# EAGLE design detector_full (EAGLE 9.0.1)
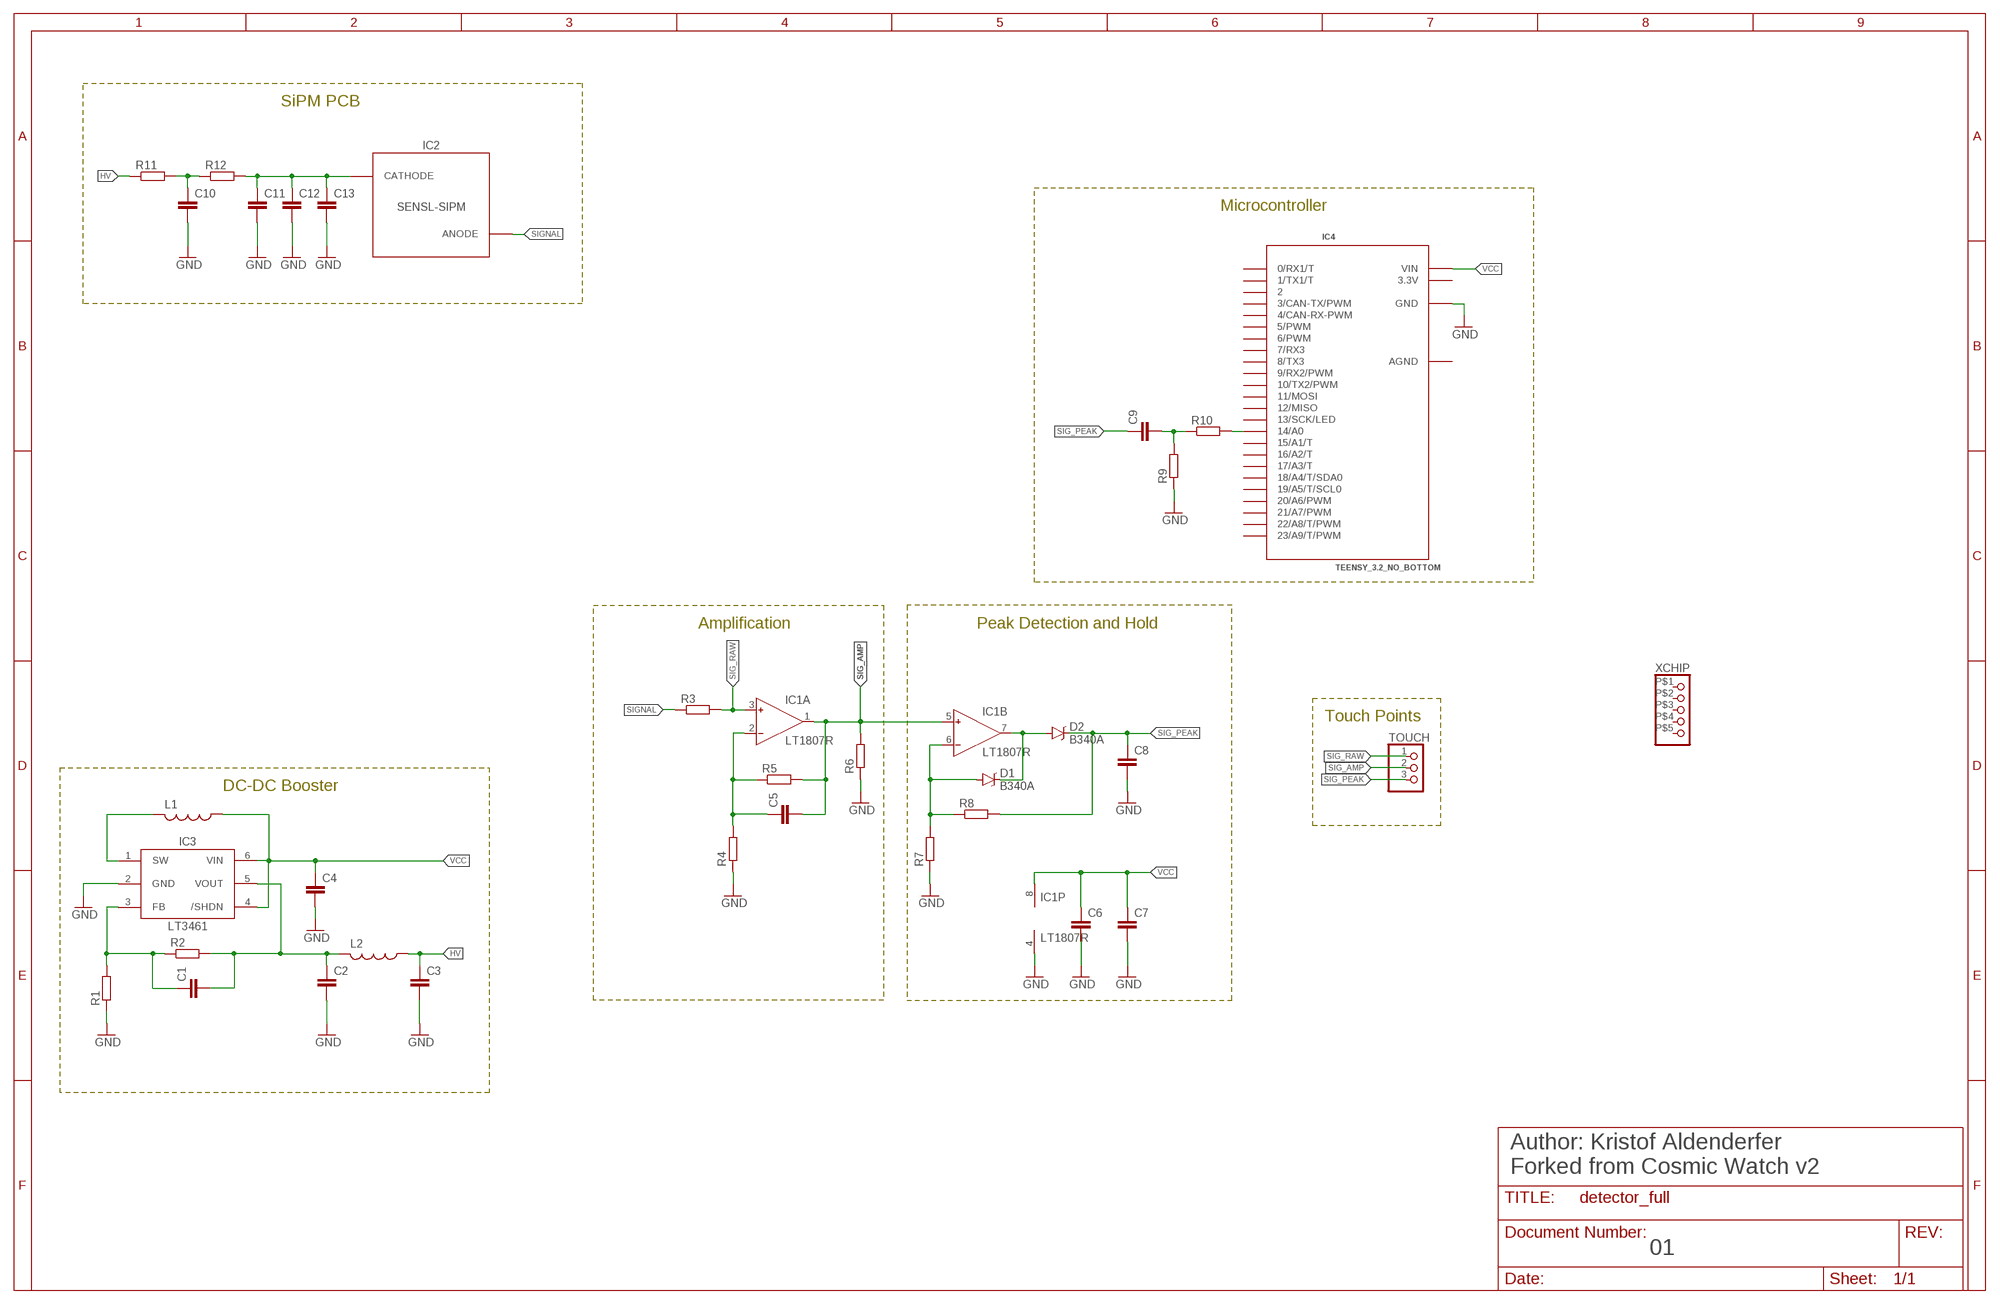
[diagram p0: schematic, sheet 1]

## Parts
C1  C-EUC0805K  [C0805K]
C2  C-EUC0805K  [C0805K]
C3  C-EUC0805K  [C0805K]
C4  C-EUC0805K  [C0805K]
C5  C-EUC0805K  [C0805K]
C6  C-EUC0805K  [C0805K]
C7  C-EUC0805K  [C0805K]
C8  C-EUC0805K  [C0805K]
C9  C-EUC0805K  [C0805K]
C10  C-EUC0805K  [C0805K]
C11  C-EUC0805K  [C0805K]
C12  C-EUC0805K  [C0805K]
C13  C-EUC0805K  [C0805K]
D1  B340A  DIODE-SCHOTTKY-B340A  [SMA-DIODE]
D2  B340A  DIODE-SCHOTTKY-B340A  [SMA-DIODE]
IC1  LT1807R  [SO8]
IC2  SENSL-SIPM  [MICROFC-60035]
IC3  LT3461  [SOT23-6]
IC4  TEENSY_3.2_NO_BOTTOM  [TEENSY_3.2_NO_BOTTOM]
L1  L-USL2012C  [L2012C]
L2  L-USL2012C  [L2012C]
R1  R-EU_M0805  [M0805]
R2  R-EU_M0805  [M0805]
R3  R-EU_M0805  [M0805]
R4  R-EU_M0805  [M0805]
R5  R-EU_M0805  [M0805]
R6  R-EU_M0805  [M0805]
R7  R-EU_M0805  [M0805]
R8  R-EU_M0805  [M0805]
R9  R-EU_M0805  [M0805]
R10  R-EU_M0805  [M0805]
R11  R-EU_M0805  [M0805]
R12  R-EU_M0805  [M0805]
TOUCH  PINHD-1X3  [1X03]
XCHIP  XCHIP-1X5  [1X05_PAD]

## Nets
GND: C2.2 C3.2 C4.2 C6.2 C7.2 C8.2 C10.2 C11.2 C12.2 C13.2 IC1.4(P:V-) IC3.2(GND) IC4.GND R1.1 R4.1 R6.1 R7.1 R9.1
HV: C3.1 L2.1 R11.1
N$1: IC3.1(SW) L1.2
N$2: D1.C D2.A IC1.7(B:OUT)
N$3: C1.1 IC3.3(FB) R1.2 R2.1
N$4: D1.A IC1.6(B:IN-) R7.2 R8.1
N$5: C11.1 C12.1 C13.1 IC2.CATHODE R12.2
N$6: C10.1 R11.2 R12.1
N$7: C1.2 C2.1 IC3.5(VOUT) L2.2 R2.2
N$8: C5.1 IC1.2(A:IN-) R4.2 R5.1
N$9: C9.2 R9.2 R10.1
N$10: IC4.14/A0 R10.2
SIG_AMP: C5.2 IC1.1(A:OUT) IC1.5(B:IN+) R5.2 R6.2 TOUCH.2
SIG_PEAK: C8.1 C9.1 D2.C R8.2 TOUCH.3
SIG_RAW: IC1.3(A:IN+) R3.2 TOUCH.1
SIGNAL: IC2.ANODE R3.1
VCC: C4.1 C6.1 C7.1 IC1.8(P:V+) IC3.4(/SHDN) IC3.6(VIN) IC4.VIN L1.1
Unconnected: IC4.0(0/RX1/T) IC4.1(1/TX1/T) IC4.2 IC4.3(3/CAN-TX/PWM) IC4.4(4/CAN-RX-PWM) IC4.5(5/PWM) IC4.6(6/PWM) IC4.7(7/RX3) IC4.8(8/TX3) IC4.9(9/RX2/PWM) IC4.10(10/TX2/PWM) IC4.11(11/MOSI) IC4.12(12/MISO) IC4.13(13/SCK/LED) IC4.15/A1(15/A1/T) IC4.16/A2(16/A2/T) IC4.17/A3(17/A3/T) IC4.18/A4(18/A4/T/SDA0) IC4.19/A5(19/A5/T/SCL0) IC4.20/A6(20/A6/PWM) IC4.21/A7(21/A7/PWM) IC4.22/A8(22/A8/T/PWM) IC4.23/A9(23/A9/T/PWM) XCHIP.P$1 XCHIP.P$2 XCHIP.P$3 XCHIP.P$4 XCHIP.P$5

## Notes on the sheet
- SiPM PCB
- Microcontroller
- Amplification | Peak Detection and Hold
- Touch Points
- DC-DC Booster
- Author: Kristof Aldenderfer
  Forked from Cosmic Watch v2
- 01

## Power pins joined to a net without a drawn wire
3.3V: IC4.3.3V
AGND: IC4.AGND

## Library data of the parts
C1-C13 = rcl:C-EU: CAPACITOR, European symbol; SPICEPREFIX: C
D1 D2 = SparkFun-DiscreteSemi:DIODE-SCHOTTKY: Schottky diodes in SFE's production catalog BAT20J 1A 23V 0.62Vf RB751 120mA 40V 0.37Vf PMEG4005EJ 0.5A 40V 0.42Vf MBRA140 1A 40V 0.5Vf B340A 3A 40V SMA; PROD_ID: DIO-09886
IC1 = personal:LT1807: Dual Precision, 500 ns Settling, BiFET Op Amp Source: http://www.analog.com/static/imported-files/data_sheets/AD746.pdf; MF: ALTERA CORPORATION; MPN: AD746JRZ; OC_FARNELL: 1423876; OC_NEWARK: 59K4845
IC2 = personal:SENSL-SIPM
IC3 = personal:LT3461: LT3426 1.2MHz, 2A boost converter in SOT-23 http://www.linear.com/pc/productDetail.jsp?navId=H0,C1,C1003,C1042,C1031,C1061,P8430 (Linear website)
IC4 = personal:TEENSY_3.2_NO_BOTTOM: Footprint for Teensy 3.1 board using all pin connections on the outer perimeter
L1 L2 = rcl:L-US: INDUCTOR, American symbol; SPICEPREFIX: L
R1-R12 = rcl:R-EU_: RESISTOR, European symbol; SPICEPREFIX: R
TOUCH = pinhead:PINHD-1X3: PIN HEADER
XCHIP = personal:XCHIP-1X5: PIN HEADER

## Board
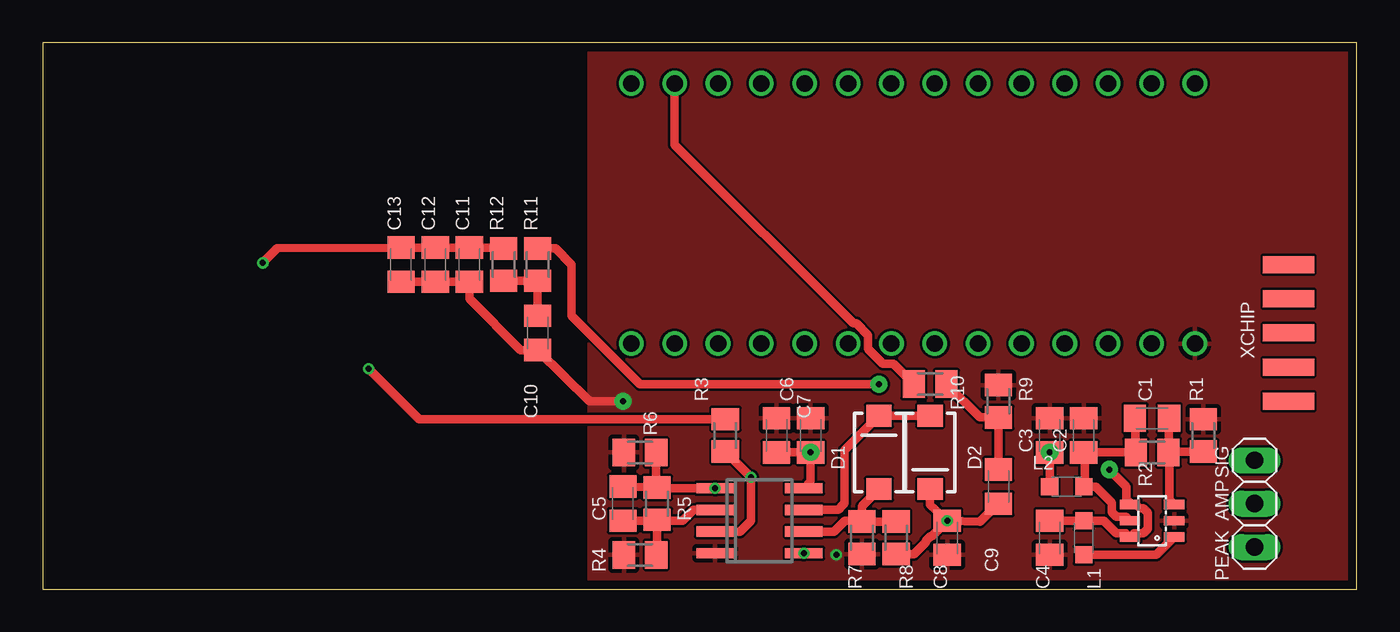
[diagram p1: board, top side]
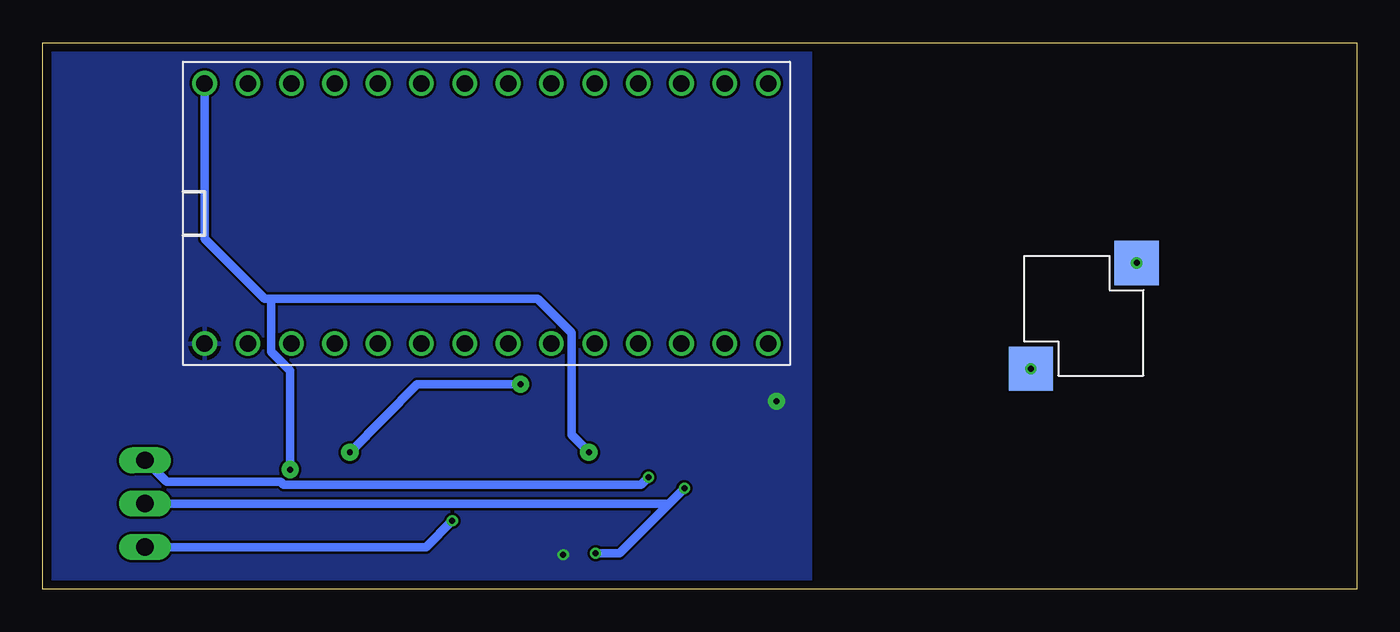
[diagram p2: board, bottom side, seen from below]

Size 77 x 32 mm. Coordinates in mm from the lower left corner, seen from the top.
Outline: 0,0 77,0 77,32 0,32 0,0
Copper layers (1*16): Top 0.035mm / dielectric 1.6mm / Bottom 0.035mm
Design rules "Elecrow_2-layer_PCB_eagle_rule": minimum track width 6mil, minimum drill 12mil, track to track 6mil, track to pad 8mil, pad to pad 12mil, via to via 12mil, smd to smd 0mil, copper to edge 20mil, drill to drill 10mil, minimum pad ring 6mil, minimum via ring 6mil, stop-mask expansion 0mil, vias tented up to drill 100mil, thermal gap 10mil

### Footprints (pad centres in the part's own frame; a part is rotated, then mirrored left to right if it is on the bottom)
C0805K = smd 1.3 x 1.6: 1 -1,0; 2 1,0
SMA-DIODE = smd 1.27 x 1.47: A -2.15,0; C 2.15,0
SO8 = smd 0.6 x 2.2: 1 -1.905,-2.6; 2 -0.635,-2.6; 3 0.635,-2.6; 4 1.905,-2.6; 5 1.905,2.6; 6 0.635,2.6; 7 -0.635,2.6; 8 -1.905,2.6
MICROFC-60035 = smd 2.6 x 2.6: ANODE -3.1,-3.1; CATHODE 3.1,3.1
SOT23-6 = smd 0.55 x 1.2: 1 -0.95,-1.3; 2 0,-1.3; 3 0.95,-1.3; 4 0.95,1.3; 5 0,1.3; 6 -0.95,1.3
TEENSY_3.2_NO_BOTTOM = drill 0.965: 0 -7.62,13.97; 1 -7.62,11.43; 2 -7.62,8.89; 3 -7.62,6.35; 3.3V 7.62,11.43; 4 -7.62,3.81; 5 -7.62,1.27; 6 -7.62,-1.27; 7 -7.62,-3.81; 8 -7.62,-6.35; 9 -7.62,-8.89; 10 -7.62,-11.43; 11 -7.62,-13.97; 12 -7.62,-16.51; 13 7.62,-16.51; 14/A0 7.62,-13.97; 15/A1 7.62,-11.43; 16/A2 7.62,-8.89; 17/A3 7.62,-6.35; 18/A4 7.62,-3.81; 19/A5 7.62,-1.27; 20/A6 7.62,1.27; 21/A7 7.62,3.81; 22/A8 7.62,6.35; 23/A9 7.62,8.89; AGND 7.62,13.97; GND -7.62,16.51; VIN 7.62,16.51
L2012C = smd 1 x 1: 1 -1,0; 2 1,0
M0805 = smd 1.3 x 1.6: 1 -0.95,0; 2 0.95,0
1X03 = drill 1.016 long: 1 -2.54,0; 2 0,0; 3 2.54,0
1X05_PAD = smd 1 x 3: P$1 -4,0; P$2 -2,0; P$3 0,0; P$4 2,0; P$5 4,0

### Placement (x,y rotation side)
C1  65,10 180 top
C2  61,9 90 top
C3  59,9 90 top
C4  59,3 270 top
C5  34,5 90 top
C6  43,9 90 top
C7  45,9 90 top
C8  53,3 270 top
C9  56,6 90 top
C10  29,15 270 top
C11  25,19 270 top
C12  23,19 270 top
C13  21,19 270 top
D1  49,8 90 top
D2  52,8 270 top
IC1  42,4 270 top
IC2  16,16 0 bottom
IC3  65,4 90 top
IC4  51,22 90 bottom
L1  61,3 270 top
L2  60,6 0 top
R1  68,9 270 top
R2  65,8 180 top
R3  40,9 270 top
R4  35,2 0 top
R5  36,5 90 top
R6  35,8 0 top
R7  48,3 90 top
R8  50,3 270 top
R9  56,11 270 top
R10  52,12 180 top
R11  29,19 270 top
R12  27,19 90 top
TOUCH  71,5 270 top
XCHIP  73,15 90 top

### Tracks (layer width: path | path; a pad name or v marks a point on that pad's centre or on a via)
GND  (via drill 0.35, 0.35 pad 1)
  Top 0.5: v34,11 32.05,11 C10.2 28,14 25,17 C11.2 C12.2 C13.2
  other vias: 46.5,2
  pour Bottom: 32,-1 79,-1 79,33 32,33
  pour Top: 32,-2 80,-2 80,34 32,34
HV  (via drill 0.35 pad 1)
  Top 0.5: C3.1 L2.1 | R11.1 30.05,19.95 31,19 31,16 35,12 v49,12
  Bottom 0.5: C3.1 55.05,12 v49,12
  other vias: 59,8
N$1
  Top 0.5: IC3.1 65.25,2 L1.2
N$2
  Top 0.5: IC1.7 46.63,4.63 46.75,4.75 46.75,4.79 46.98,5.02 46.98,8.13 D1.C D2.A
N$3
  Top 0.5: R1.2 66,8.05 | 66,8.05 R2.1 C1.1 | IC3.3 66,5.25 66,8.05
N$4
  Top 0.5: IC1.6 46.37,3.37 47,4 47.95,4 R7.2 | R8.1 R7.2 | D1.A 48,4.85 R7.2
N$5  (via drill 0.35)
  Top 0.5: IC2.CATHODE 13.75,19.95 C13.1 C12.1 C11.1 26.95,20 R12.2
  other vias: 12.9,19.1
N$6
  Top 0.5: C10.1 R11.2 R12.1
N$7
  Top 0.5: IC3.5 63.48,4.22 62.91,4.22 62.65,4.49 62.65,5.05 61.7,6 L2.2 61.05,6.05 61.05,8 | C1.2 R2.2 61.05,8 | 61.05,8 C2.1
N$8
  Top 0.5: R4.2 36,2.05 36,4 | 36,4 R5.1 | C5.1 34.05,4 36,4 | IC1.2 38.13,4.63 37.5,4 36,4
N$9
  Top 0.5: C9.2 R9.2 54.9,10.05 R10.1
N$10
  Top 0.5: IC4.14/A0 37.03,26.02 47.49,15.56 47.68,15.56 48.37,14.87 48.37,14.08 49.24,13.2 49.85,13.2 R10.2
SIG_AMP  (via drill 0.35)
  Top 0.5: C5.2 R5.2 | R5.2 35.95,6 R6.2 | IC1.1 36.05,5.91 R5.2
  Bottom 0.5: v44.6,2.1 43.21,2.1 IC1.1 40.3,5 TOUCH.2
  other vias: 39.4,5.91
SIG_PEAK  (via drill 0.35)
  Top 0.5: C8.1 52,4.95 D2.C | C8.1 54.9,3.95 C9.1 | R8.2 51.05,2.05 51.75,2.75 51.75,2.84 52.01,3.1 52.1,3.1 C8.1
  Bottom 0.5: TOUCH.3 54.54,2.46 C8.1
  other vias: 53,4
SIG_RAW  (via drill 0.35)
  Top 0.5: IC1.3 40.87,3.37 41.5,4 v41.5,6.55 R3.2
  Bottom 0.5: TOUCH.1 69.73,6.27 63.05,6.27 62.87,6.1 41.95,6.1 v41.5,6.55
SIGNAL  (via drill 0.35)
  Top 0.5: IC2.ANODE 22.05,9.95 R3.1
  other vias: 19.1,12.9
VCC  (via drill 0.35 pad 1)
  Top 0.5: 63.75,5 64,5 64.27,4.73 64.49,4.73 64.75,4.46 64.75,3.54 64.49,3.27 63.92,3.27 IC3.6 63.48,3.27 62.91,3.27 62.18,4 L1.1 59.05,4 C4.1 | 63.75,5 IC3.4 | IC1.8 45,6.3 C7.1 C6.1 | v62.5,7 63.5,6 63.5,5.25 63.75,5
  Bottom 0.5: v62.5,7 62.5,12.79 63.61,13.89 63.61,16.89 63.5,17 | C7.1 46,9.05 46,15 48,17 63.5,17 | IC4.VIN 67.51,20.51 64,17 63.5,17
  other vias: 45,8

### Text on the board
tNames: SIG | AMP | PEAK